# Altium schematic sheet lab_1_kapustin_usb_spi.SchDoc: =title_line_1 + title_line_2
size 594 x 420 mm; SheetNumber: 1
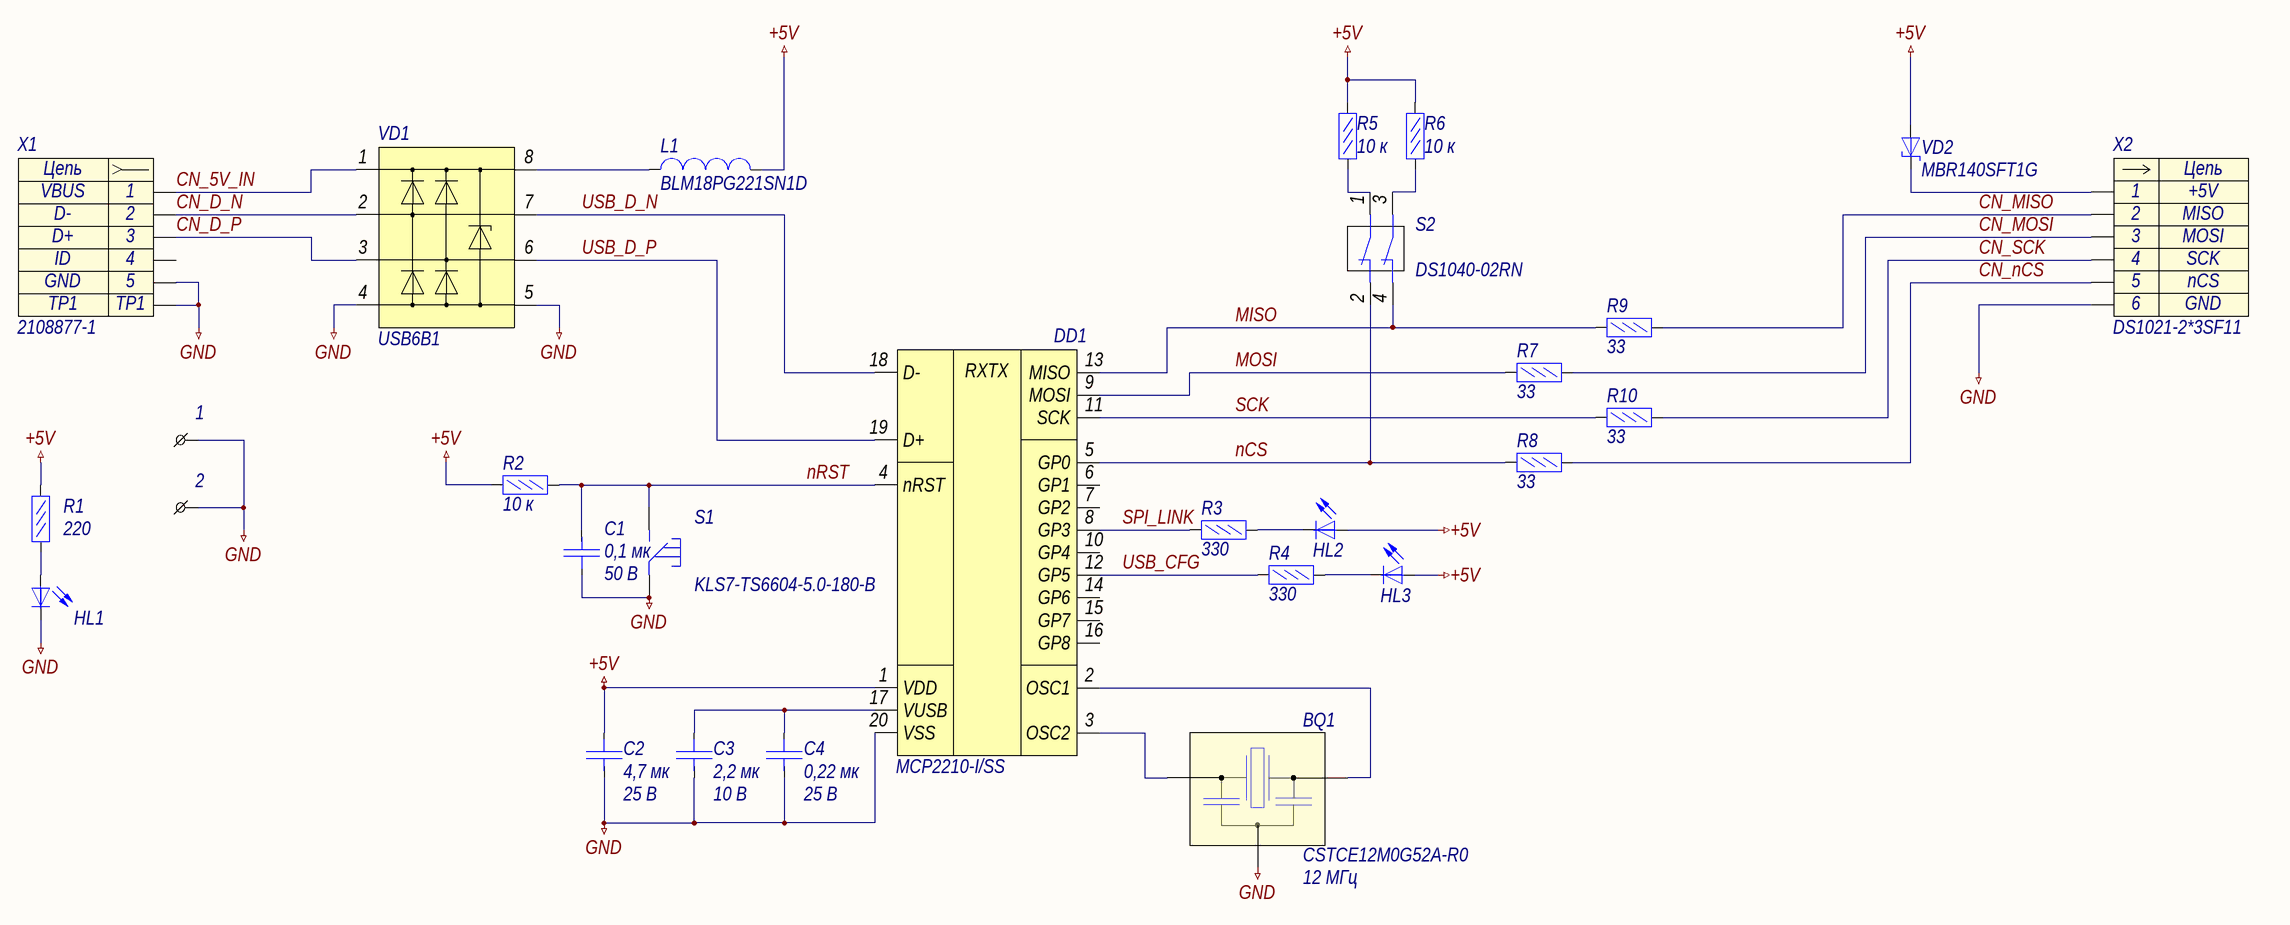
[diagram p0: lab_1_kapustin_usb_spi.SchDoc]

## Parts
1  MOUNTING_HOLE  [HOLE_1,6X3,3]  (value not drawn)
2  MOUNTING_HOLE  [HOLE_1,6X3,3]  (value not drawn)
BQ1  CSTCE12M0G52A-R0  Частота: 12 МГц  [CSTCE-3_320x130x40]
C1  0,1 мк  Напряжение: 50 В  [C0603]
C2  4,7 мк  Напряжение: 25 В  [C0603]
C3  2,2 мк  Напряжение: 10 В  [C0603]
C4  0,22 мк  Напряжение: 25 В  [C0603]
DD1  MCP2210-I/SS  [SSOP-20_780x720x200]
HL1  KP-1608SGC  [D0603]  (value not drawn)
HL2  KP-1608YC  [D0603]  (value not drawn)
HL3  KP-1608YC  [D0603]  (value not drawn)
L1  BLM18PG221SN1D  [L0603]
R1  220  [R0603]
R2  10 к  [R0603]
R3  330  [R0603]
R4  330  [R0603]
R5  10 к  [R0603]
R6  10 к  [R0603]
R7  33  [R0603]
R8  33  [R0603]
R9  33  [R0603]
R10  33  [R0603]
S1  KLS7-TS6604-5.0-180-B  [KLS7-TS6604_500]
S2  DS1040-02RN  [DS1040-02RN]
VD1  USB6B1  [SO-8]
VD2  MBR140SFT1G  [SOD-123FL_290X180X98]
X1  2108877-1  [2108877-1]
X2  DS1021-2*3SF11  [PLS-2,54-2X3-THT-V]

## Nets
+5V: C2.1 DD1.1(VDD) HL2.1(A) HL3.1(A) L1.2 R1.2 R2.1 R5.2 R6.2 VD2.1(A)
GND: 1.1 2.1 BQ1.2 C1.1 C2.2 C3.2 C4.2 DD1.20(VSS) HL1.2(K) S1.1 VD1.4 VD1.5 X1.5 X1.TP1 X2.6
CN_5V_IN: VD1.1 X1.1
CN_D_N: VD1.2 X1.2
CN_D_P: VD1.3 X1.3
CN_MISO: R9.2 X2.2
CN_MOSI: R7.2 X2.3
CN_nCS: R8.2 X2.5
CN_SCK: R10.2 X2.4
MISO: DD1.13(MISO) R9.1 S2.4
MOSI: DD1.9(MOSI) R7.1
nCS: DD1.5(GP0) R8.1 S2.2
nRST: C1.2 DD1.4(nRST) R2.2 S1.2
SCK: DD1.11(SCK) R10.1
SPI_LINK: DD1.8(GP3) R3.1
USB_CFG: DD1.12(GP5) R4.1
USB_D_N: DD1.18(D-) VD1.7
USB_D_P: DD1.19(D+) VD1.6
NetBQ1_1: BQ1.1 DD1.2(OSC1)
NetBQ1_3: BQ1.3 DD1.3(OSC2)
NetC3_1: C3.1 C4.1 DD1.17(VUSB)
NetHL1_1: HL1.1(A) R1.1
NetHL2_2: HL2.2(K) R3.2
NetHL3_2: HL3.2(K) R4.2
NetL1_1: L1.1 VD1.8
NetR5_1: R5.1 S2.1
NetR6_1: R6.1 S2.3
NetVD2_2: VD2.2(K) X2.1

Not connected (* = marked no-connect by the designer): DD1 6(GP1) 7(GP2) 10(GP4) 14(GP6) 15(GP7) 16(GP8); X1 4

## Notes on the sheet
- Перв. примен.
- Справ. №
- Подп. и дата
- Инв. № дубл.
- Нормоконтроль:
- Взам. инв. №
- Изм.
- Лист
- № докум.
- Подп.
- Дата
- Лит.
- Масса
- Масштаб
- Т.контр.
- Пров.
- Разраб.
- Листов
- Разработал:
- Инв. № подл.
- Н.контр.
- Утв.
- Копировал
- Формат
- А2
- (in symbol 2108877-1_micro_usb-b) Цепь
- (in symbol cn0076) Цепь
- (in symbol MCP2210ISS) RXTX

## Library data of the parts
1 2 = fstn0011: Описание: Отверстие под М1,5; Наименование: Отверстие 1,6x3,3; Диаметр отверстия: 1,6 мм; Параметры металлизации: 3,3 мм; id: fstn0011
BQ1 = q0001: id: q0001; Фамилия: Капустин; Описание: Кварцевый резонатор 12 МГц со встроенными нагрузочными конденсаторами; Производитель: Murata; Точность: ±0,5 %; Промывка: Разрешена; Температура окружающей среды (корпуса), мин#: -40 °C; Температура окружающей среды (корпуса), макс#: +125 °C; Корпус: 3,2*1,3*0,7; Наименование: CSTCE12M0G52A-R0; HelpURL: https://www.murata.com/en-us/api/pdfdownloadapi?cate=&partno=CSTCE12M0G52A-R0
C1 = c0007: Конденсатор; id: c0007; Фамилия: Черемный; Описание: Конденсатор керамический 0603 0,1 мкФ 50 В ±10 % X7R; Наименование: CL10B104KB8NNN; Производитель: Samsung; Корпус: 0603; Отклонение: ±10 %; ТКЕ: X7R; Примечание: В наименовании убрана последняя буква, обозначающая упаковку; ClassName: *; Номинал: 0,1 мк; HelpURL: http://weblib.samsungsem.com/mlcc/mlcc-ec-data-sheet.do?partNumber=CL10B104KB8NNN
C2 = c0009: Конденсатор; id: c0009; Фамилия: Черемный; Описание: Конденсатор керамический 0603 4,7 мкФ 25 В ±10 % X5R; Наименование: CL10A475KA8NQN; Производитель: Samsung; Корпус: 0603; Отклонение: ±10 %; ТКЕ: X5R; Примечание: В наименовании убрана последняя буква, обозначающая упаковку; ClassName: *; Номинал: 4,7 мк; HelpURL: http://weblib.samsungsem.com/mlcc/mlcc-ec-data-sheet.do?partNumber=CL10A475KA8NQN
C3 = c0020: Конденсатор; id: c0020; Фамилия: Черемный; Описание: Конденсатор керамический 0603 2,2 мкФ 10 В ±10 % X7R; Наименование: CL10B225KP8NNN; Производитель: Samsung; Корпус: 0603; Отклонение: ±10 %; ТКЕ: X7R; Примечание: В наименовании убрана последняя буква, обозначающая упаковку; ClassName: *; Номинал: 2,2 мк; HelpURL: http://weblib.samsungsem.com/mlcc/mlcc-ec-data-sheet.do?partNumber=CL10B225KP8NNN
C4 = c0027: Конденсатор; id: c0027; Фамилия: Черемный; Описание: Конденсатор керамический 0603 0,22 мкФ 25 В ±10 % X7R; Наименование: CL10B224KA8NNN; Производитель: Samsung; Корпус: 0603; Отклонение: ±10 %; ТКЕ: X7R; Примечание: В наименовании убрана последняя буква, обозначающая упаковку; ClassName: *; Номинал: 0,22 мк; HelpURL: http://weblib.samsungsem.com/mlcc/mlcc-ec-data-sheet.do?partNumber=CL10B224KA8NNN
DD1 = MCP2210ISS: Наименование: MCP2210-I/SS
HL1 = led0004: Фамилия: Капустин; Описание: Светодиод зеленый SMD 0603; Производитель: Kingbright; Цвет: Зеленый; Максимальное обратное напряжение: 5 В; Прямой ток: 20 мА; Максимальное прямое напряжение: 2,5 В; Максимальный обратный ток: 11 мкА; Максимальный импульсный прямой ток: 140 мА; Температура окружающей среды (корпуса), мин#: -40 °C; Температура окружающей среды (корпуса), макс#: +85 °C; Примечание: Не найти документацию на свйте производителя; ClassName: *; id: led0004; Наименование: KP-1608SGC; Корпус: D0603; HelpURL: http://www.farnell.com/datasheets/2045827.pdf?_ga=2.72147859.1066726363.1573580702-223521920.1573064505
HL2 HL3 = led0003: Фамилия: Капустин; Описание: Светодиод желтый SMD 0603; Производитель: Kingbright; Цвет: Желтый; Максимальное обратное напряжение: 5 В; Прямой ток: 20 мА; Максимальное прямое напряжение: 2,5 В; Максимальный обратный ток: 10 мкА; Максимальный импульсный прямой ток: 140 мА; Температура окружающей среды (корпуса), мин#: -40 °C; Температура окружающей среды (корпуса), макс#: +85 °C; Примечание: Не найти документацию на свйте производителя; ClassName: *; id: led0003; Наименование: KP-1608YC; Корпус: D0603; HelpURL: http://www.farnell.com/datasheets/2045948.pdf?_ga=2.105218179.1066726363.1573580702-223521920.1573064505
L1 = ind0014: Фамилия: Капустин; Описание: Ферритовая бусина 220 Ом @ 100МГц; Производитель: Murata; Номинал: 220 Ом; Индуктивность: 220 Ом @ 100 МГц; Отклонение: ±25%; Сопротивление обмотки: 0,1 Ом; Максимальный ток: 1,4 А; Добротность: не указана; Температура окружающей среды (корпуса), мин#: -55 °C; Температура окружающей среды (корпуса), макс#: +125 °C; Корпус: 0603; ClassName: *; id: ind0014; Наименование: BLM18PG221SN1D; HelpURL: https://www.murata.com/en-eu/products/productdetail?partno=BLM18PG221SN1%23
R1 = r0232: Резистор 0,063Вт; id: r0232; Фамилия: Капустин; Описание: Резистор чип 0603 220 Ом 0,1 Вт ±1 %; Наименование: RC0603FR-07220RL; Производитель: YAGEO; Отклонение: ±1 %; Напряжение: 75 В; Температурный коэффициент сопротивления: 200 ppm; Температура окружающей среды (корпуса), мин#: -55 °C; Температура окружающей среды (корпуса), макс#: +155 °C; Корпус: 0603; ClassName: *; Номинал: 220; HelpURL: https://www.yageo.com/upload/media/product/products/datasheet/rchip/PYu-RC_Group_51_RoHS_L_10.pdf
R2 R5 R6 = r0006: Резистор 0,063Вт; id: r0006; Фамилия: Капустин; Описание: Резистор чип 0603 10 кОм 0,1 Вт ±1 %; Наименование: RC0603FR-0710KL; Производитель: YAGEO; Отклонение: ±1 %; Напряжение: 75 В; Температурный коэффициент сопротивления: 200 ppm; Температура окружающей среды (корпуса), мин#: -55 °C; Температура окружающей среды (корпуса), макс#: +155 °C; Корпус: 0603; ClassName: *; Номинал: 10 к; HelpURL: https://www.yageo.com/upload/media/product/products/datasheet/rchip/PYu-RC_Group_51_RoHS_L_10.pdf
R3 R4 = r0034: Резистор 0,063Вт; id: r0034; Фамилия: Капустин; Описание: Резистор чип 0603 300 Ом 0,1 Вт ±1 %; Наименование: RC0603FR-07330RL; Производитель: YAGEO; Отклонение: ±1 %; Напряжение: 75 В; Температурный коэффициент сопротивления: 100 ppm; Температура окружающей среды (корпуса), мин#: -55 °C; Температура окружающей среды (корпуса), макс#: +155 °C; Корпус: 0603; ClassName: *; Номинал: 330; HelpURL: https://www.yageo.com/upload/media/product/products/datasheet/rchip/PYu-RC_Group_51_RoHS_L_10.pdf
R7-R10 = r0214: Резистор 0,063Вт; id: r0214; Фамилия: Капустин; Описание: Резистор чип 0603 33 Ом 0,1 Вт ±1 %; Наименование: RC0603FR-0733RL; Производитель: YAGEO; Отклонение: ±1 %; Напряжение: 75 В; Температурный коэффициент сопротивления: 200 ppm; Температура окружающей среды (корпуса), мин#: -55 °C; Температура окружающей среды (корпуса), макс#: +155 °C; Корпус: 0603; ClassName: *; Номинал: 33; HelpURL: https://www.yageo.com/upload/media/product/products/datasheet/rchip/PYu-RC_Group_51_RoHS_L_10.pdf
S1 = sw0003: id: sw0003; Капустин: Черемный; Описание: Тактовая кнопка поверхностного монтажа; Производитель: KLS; Количество контактов: 4; Ток нагрузки: 50 мА @ 12 В; Сопротивление контакта: 50 мОм; Промывка: Не указано (запрещена); Температура окружающей среды (корпуса), мин#: -20 °C; Температура окружающей среды (корпуса), макс#: +70 °C; Корпус: 6х6х3,5; Наименование: KLS7-TS6604-5.0-180-B; HelpURL: http://www.klsele.com/admin/product_upload/20120515130956KLS7-TS6604.pdf
S2 = sw0002: id: sw0002; Описание: 2-х позиционный движковый переключатель; Производитель: Connfly Electronic Co. LTD; Количество контактов: 2; Ток нагрузки: 100 мА @ 24 В; Сопротивление контакта: 100 мОм; Промывка: Запрещена; Температура окружающей среды (корпуса), мин#: -40 °C; Температура окружающей среды (корпуса), макс#: +105 °C; Корпус: 6,54х9,9х5,5; Капустин: Капустин; Наименование: DS1040-02RN; HelpURL: http://www.connfly.com/userfiles/image/UpLoadFile/File/2017/1/20/DS1040-N.pdf
VD1 = asmvd0007: Фамилия: Капустин; Описание: Диодная сборка для защиты USB; Производитель: ST Microelectronics; Температура окружающей среды (корпуса), мин#: -40 °C; Температура окружающей среды (корпуса), макс#: +85 °C; id: asmvd0007; Наименование: USB6B1; Корпус: SO-8; HelpURL: https://www.st.com/resource/en/datasheet/usb6b1.pdf
VD2 = vd0004: id: vd0004; Фамилия: Капустин; Описание: Диод Шоттки 40 В 1 А; Производитель: ON Semiconductor; Максимальное обратное напряжение: 40 В; Максимальный прямой ток: 1 А; Максимальное прямое напряжение: 0,88 В; Максимальный обратный ток: 10 мА @ Ta = 125°C; Максимальный импульсный прямой ток: 30 А; Температура окружающей среды (корпуса), мин#: -55 °C; Температура окружающей среды (корпуса), макс#: +125 °C; Корпус: SOD-123; ClassName: *; Наименование: MBR140SFT1G; HelpURL: https://www.onsemi.com/pub/Collateral/MBR140SFT1-D.PDF
X1 = 2108877-1_micro_usb-b: Contact_1: VBUS; Contact_2: D-; Contact_3: D+; Contact_4: ID; Contact_5: GND; Наименование: 2108877-1
X2 = cn0076: Contact_01: +5V; Contact_02: MISO; Contact_03: MOSI; Contact_04: SCK; Contact_05: nCS; Contact_06: GND; id: cn0076; Фамилия: Капустин; Описание: PLS 6-ти контактный прямой двухрядный (2,54 мм); Производитель: Connfly Electronic Co. LTD; Количество контактов: 6; Цвет: Черный; Ток на контакт: 3 А; Напряжение: 250 В; Шаг: 2,54 мм; Семейство: PLS; Тип вывода: Прямой; Температура окружающей среды (корпуса), мин#: -40 °C; Температура окружающей среды (корпуса), макс#: +105 °C; Альтернатива: не указана; Ответная часть: DS1023-2*3S22; Контакт: отсутствует; ClassName: +5V; Наименование: DS1021-2*3SF11; HelpURL: http://www.connfly.com/userfiles/image/UpLoadFile/File/2015/1/29/DS1021.pdf